# Altium schematic sheet Peripherals.SchDoc
size A3; SheetNumber: 7; SheetTotal: 13
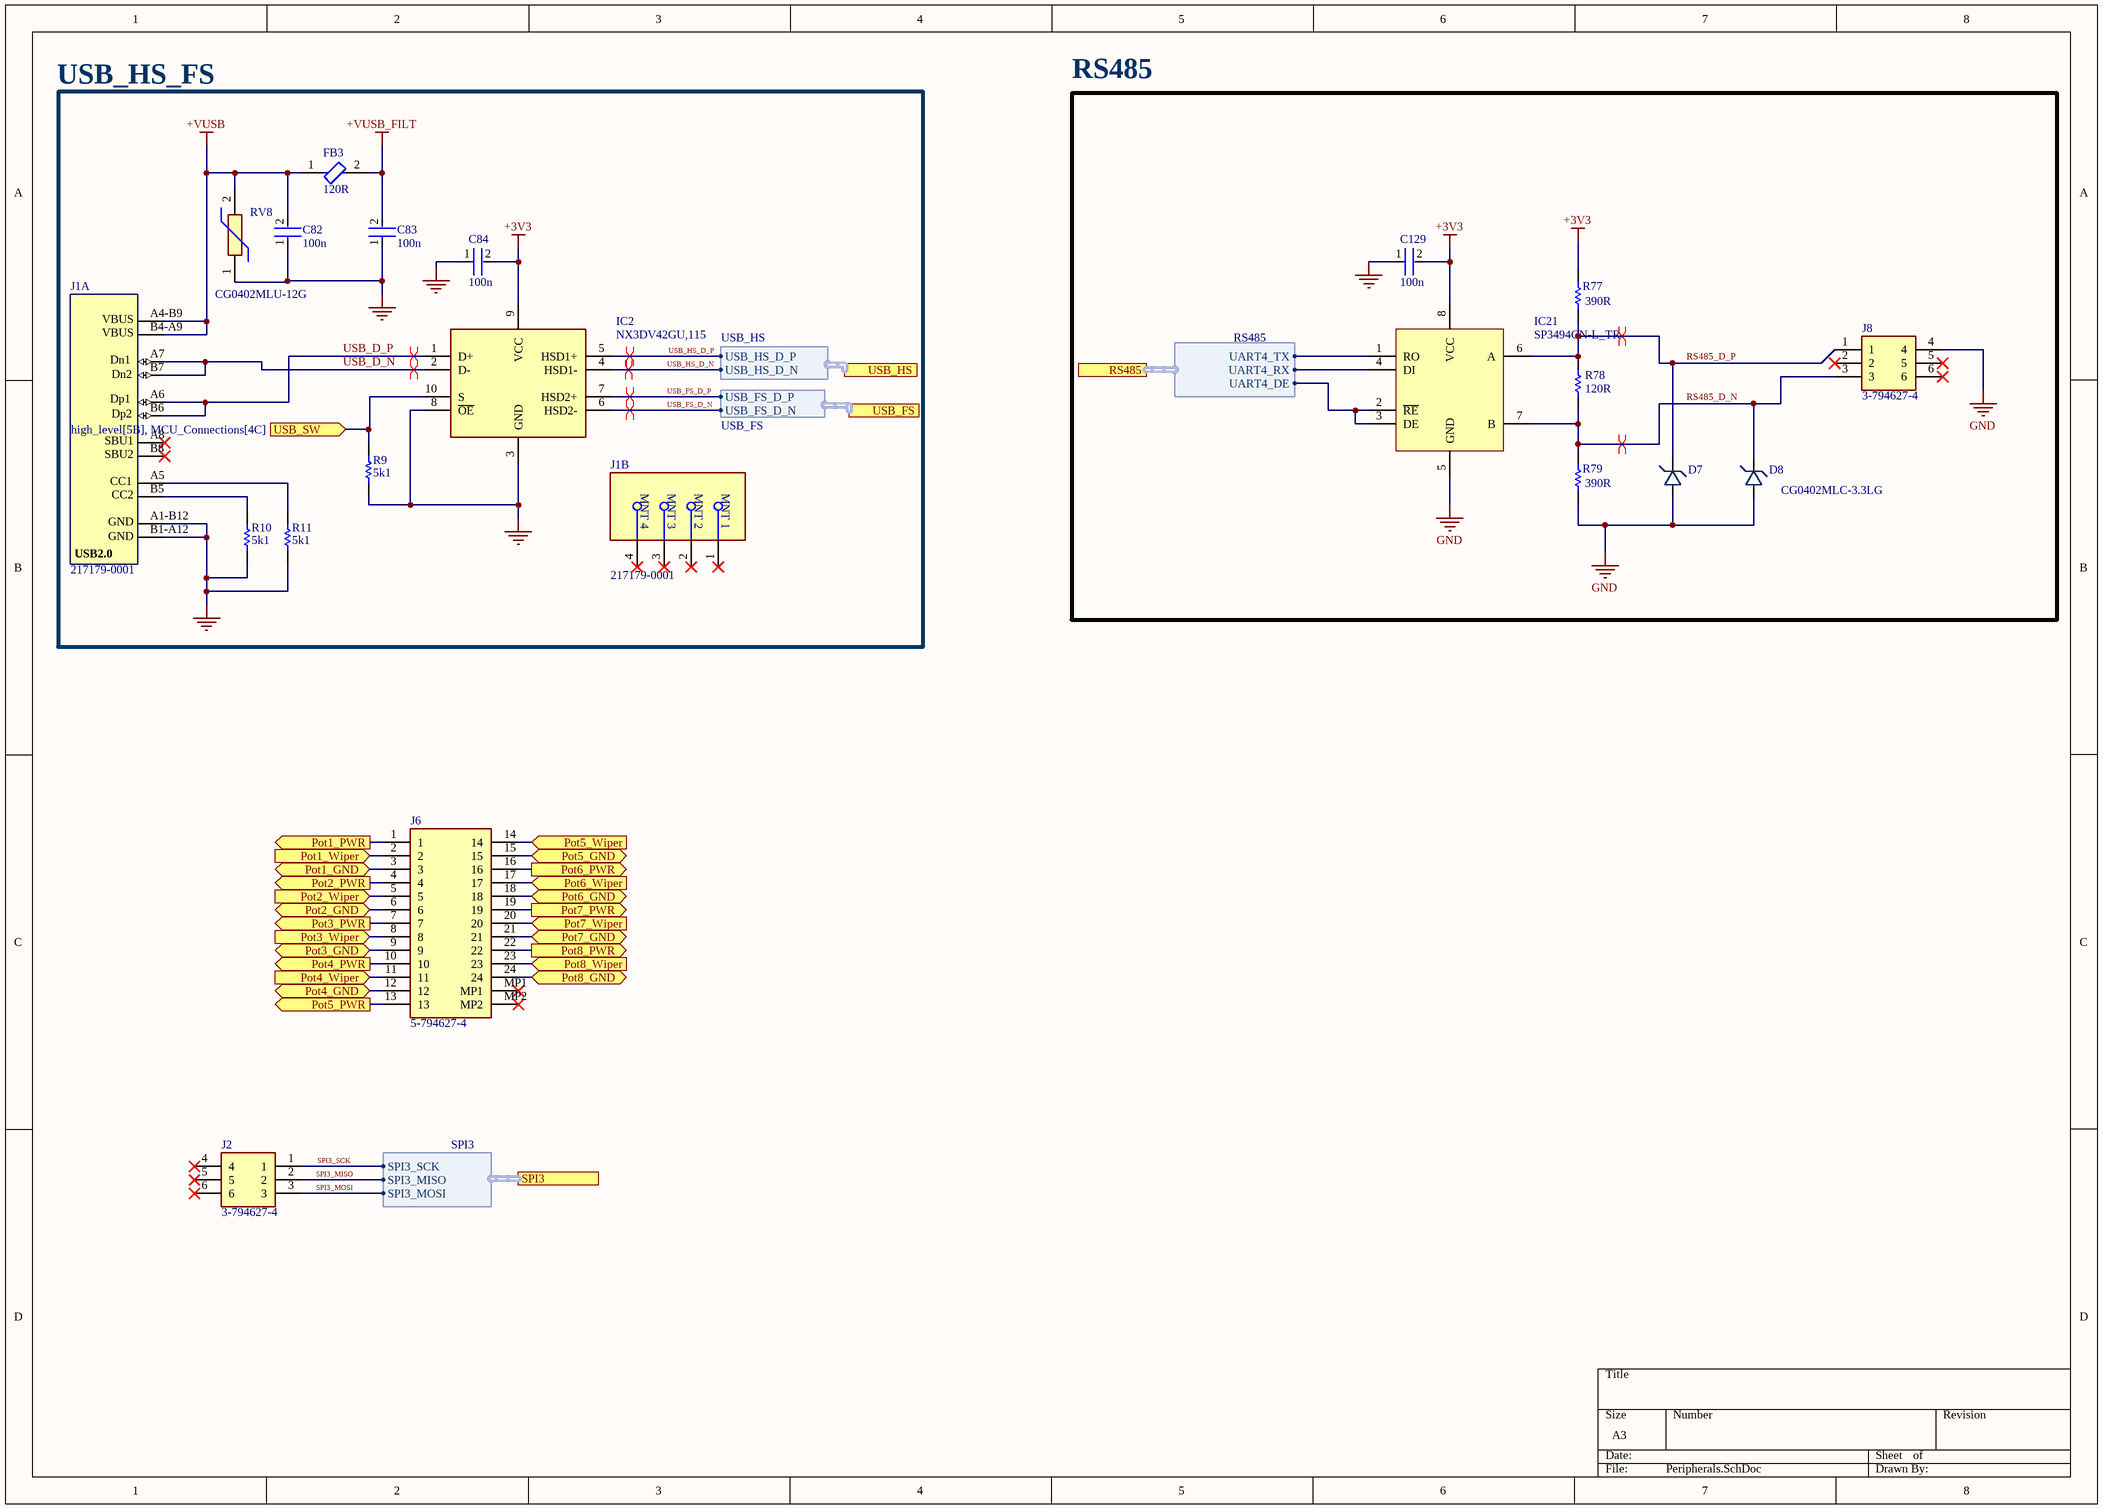
[diagram p0: Peripherals.SchDoc]

## Parts
C82  Capacitance: 100n  [FP-GCM155-0_05-IPC_A]  (hidden comment: GCM155R71H104ME02J)
C83  Capacitance: 100n  [FP-GCM155-0_05-IPC_A]  (hidden comment: GCM155R71H104ME02J)
C84  Capacitance: 100n  [FP-GCM155-0_05-IPC_A]  (hidden comment: GCM155R71H104ME02J)
C129  Capacitance: 100n  [FP-GCM155-0_05-IPC_A]  (hidden comment: GCM155R71H104ME02J)
D7  CG0402MLC-3.3LG  [CG0402MLC-3.3LG]  (value not drawn)
D8  CG0402MLC-3.3LG  [CG0402MLC-3.3LG]
FB3  Impedance: 120R  [FP-MPZ1005-MFG]  (hidden comment: MPZ1005S121ET000)
IC2  NX3DV42GU,115  [QFN40P140X180X50-10N]
IC21  SP3494CN-L_TR  [SOIC127P600X175-8N]
J1  217179-0001  [FP-2171790001-MFG]  (parts A,B of 2)
J2  3-794627-4  [37946274]
J6  5-794627-4  [57946274]
J8  3-794627-4  [37946274]
R9  Resistance: 5k1  [RESC1005X40X25ML05T10]  (hidden comment: RC0402JR-075K1L)
R10  Resistance: 5k1  [RESC1005X40X25ML05T10]  (hidden comment: RC0402JR-075K1L)
R11  Resistance: 5k1  [RESC1005X40X25ML05T10]  (hidden comment: RC0402JR-075K1L)
R77  Resistance: 390R  [RESC1005X40X25ML05T10]  (hidden comment: RC0402JR-07390RL)
R78  Resistance: 120R  [RESC1005X40X25NL05T10]  (hidden comment: RC0402FR-07120RL)
R79  Resistance: 390R  [RESC1005X40X25ML05T10]  (hidden comment: RC0402JR-07390RL)
RV8  CG0402MLU-12G  [VARC1005X41N]

## Blocks framed on the sheet
USB_HS_FS: C82-C84 FB3 IC2 J1 R9-R11 RV8
RS485: C129 D7 D8 IC21 J8 R77-R79

## Ports
Pot1_GND (bidir, see high_level[5C], Potentiometers[1B]), Pot1_PWR (out, see high_level[5C], Potentiometers[1A]), Pot1_Wiper (in, see high_level[5C], Potentiometers[1A]), Pot2_GND (bidir, see high_level[5C], Potentiometers[1B]), Pot2_PWR (out, see high_level[5C], Potentiometers[1B]), Pot2_Wiper (in, see high_level[5C], Potentiometers[1B]), Pot3_GND (bidir, see high_level[5C], Potentiometers[1C]), Pot3_PWR (out, see high_level[5C], Potentiometers[1C]), Pot3_Wiper (in, see high_level[5C], Potentiometers[1C]), Pot4_GND (bidir, see high_level[5C], Potentiometers[5B]), Pot4_PWR (out, see high_level[5C], Potentiometers[5A]), Pot4_Wiper (in, see high_level[5C], Potentiometers[5A]), Pot5_GND (bidir, see high_level[5C], Potentiometers[5B]), Pot5_PWR (out, see high_level[5C], Potentiometers[5B]), Pot5_Wiper (in, see high_level[5C], Potentiometers[5B]), Pot6_GND (bidir, see high_level[5C], Potentiometers[5C]), Pot6_PWR (out, see high_level[5C], Potentiometers[5C]), Pot6_Wiper (in, see high_level[5C], Potentiometers[5C]), Pot7_GND (bidir, see high_level[5C], Potentiometers[1D]), Pot7_PWR (out, see high_level[5C], Potentiometers[1D]), Pot7_Wiper (in, see high_level[5C], Potentiometers[1D]), Pot8_GND (bidir, see high_level[5C], Potentiometers[5D]), Pot8_PWR (out, see high_level[5C], Potentiometers[5D]), Pot8_Wiper (in, see high_level[5C], Potentiometers[5D]), RS485 (harness RS485, see high_level[5B], MCU_Connections[4C]), SPI3 (harness SPI3, see high_level[5B], MCU_Connections[5C]), USB_FS (harness USB_FS, see high_level[5B], MCU_Connections[4C]), USB_HS (harness USB_HS, see high_level[5B], USB_HS[4B]), USB_SW (in, see high_level[5B], MCU_Connections[4C])

## Harnesses
USB_HS: USB_HS_D_P, USB_HS_D_N
USB_FS: USB_FS_D_P, USB_FS_D_N
SPI3: SPI3_SCK, SPI3_MISO, SPI3_MOSI
RS485: UART4_TX, UART4_RX, UART4_DE

## Nets
+3V3: C84.2 C129.2 IC2.9(VCC) IC21.8(VCC) R77.2
+VUSB: C82.2 FB3.1 J1.A4-B9(VBUS) J1.B4-A9(VBUS) RV8.2
+VUSB_FILT: C83.2 FB3.2
GND: C82.1 C83.1 C84.1 C129.1 D7.2 D8.2 IC2.3(GND) IC2.8(~{OE}) IC21.5(GND) J1.A1-B12(GND) J1.B1-A12(GND) J8.4 R9.1 R10.1 R11.1 R79.1 RV8.1
Pot1_GND: J6.3 ; port Pot1_GND
Pot1_PWR: J6.1 ; port Pot1_PWR
Pot1_Wiper: J6.2 ; port Pot1_Wiper
Pot2_GND: J6.6 ; port Pot2_GND
Pot2_PWR: J6.4 ; port Pot2_PWR
Pot2_Wiper: J6.5 ; port Pot2_Wiper
Pot3_GND: J6.9 ; port Pot3_GND
Pot3_PWR: J6.7 ; port Pot3_PWR
Pot3_Wiper: J6.8 ; port Pot3_Wiper
Pot4_GND: J6.12 ; port Pot4_GND
Pot4_PWR: J6.10 ; port Pot4_PWR
Pot4_Wiper: J6.11 ; port Pot4_Wiper
Pot5_GND: J6.15 ; port Pot5_GND
Pot5_PWR: J6.13 ; port Pot5_PWR
Pot5_Wiper: J6.14 ; port Pot5_Wiper
Pot6_GND: J6.18 ; port Pot6_GND
Pot6_PWR: J6.16 ; port Pot6_PWR
Pot6_Wiper: J6.17 ; port Pot6_Wiper
Pot7_GND: J6.21 ; port Pot7_GND
Pot7_PWR: J6.19 ; port Pot7_PWR
Pot7_Wiper: J6.20 ; port Pot7_Wiper
Pot8_GND: J6.24 ; port Pot8_GND
Pot8_PWR: J6.22 ; port Pot8_PWR
Pot8_Wiper: J6.23 ; port Pot8_Wiper
RS485_D_N: D8.1 IC21.7(B) J8.3 R78.1 R79.2
RS485_D_P: D7.1 IC21.6(A) J8.1 R77.1 R78.2
SPI3_MISO: J2.2 ; port SPI3.SPI3_MISO
SPI3_MOSI: J2.3 ; port SPI3.SPI3_MOSI
SPI3_SCK: J2.1 ; port SPI3.SPI3_SCK
USB_D_N: IC2.2(D-) J1.A7(Dn1) J1.B7(Dn2)
USB_D_P: IC2.1(D+) J1.A6(Dp1) J1.B6(Dp2)
USB_FS_D_N: IC2.6(HSD2-) ; port USB_FS.USB_FS_D_N
USB_FS_D_P: IC2.7(HSD2+) ; port USB_FS.USB_FS_D_P
USB_HS_D_N: IC2.4(HSD1-) ; port USB_HS.USB_HS_D_N
USB_HS_D_P: IC2.5(HSD1+) ; port USB_HS.USB_HS_D_P
USB_SW: IC2.10(S) R9.2 ; port USB_SW
NetIC21_1: IC21.1(RO) ; port RS485.UART4_TX
NetIC21_2: IC21.2(~{RE}) IC21.3(DE) ; port RS485.UART4_DE
NetIC21_4: IC21.4(DI) ; port RS485.UART4_RX
NetJ1_A5: J1.A5(CC1) R11.2
NetJ1_B5: J1.B5(CC2) R10.2

Not connected (* = marked no-connect by the designer): J1 1(MNT_1)* 2(MNT_2)* 3(MNT_3)* 4(MNT_4)* A8(SBU1)* B8(SBU2)*; J2 4* 5* 6*; J6 MP1* MP2*; J8 2* 5* 6*

## Layout directives
differential pair: (no net found under the mark), RS485_D_N, RS485_D_P, USB_D_N, USB_D_P, USB_FS_D_N, USB_FS_D_P, USB_HS_D_P

## Notes on the sheet
- (in symbol CMP-04767-000028-2, part A) USB2.0

## Library data of the parts
C82-C84 C129 = CMP-06035-028957-1: Ceramic Capacitor for Automotive 100nF ±20% 50VDC X7R 0402 Paper T/R
FB3 = CMP-08257-000274-1: Power line Ferrite Bead 120Ω @ 100MHz 1.5A DCR 0.095Ω SMD 0402; Tolerance: 25%; Number of Lines: 1; DC Resistance (DCR): 95mR; RoHS Compliant: Yes; Test Frequency: 100MHz; Length: 0.039inch; Case Code (Metric): 1005; Case/Package: 0402; Max Operating Temperature: 125°C; Max Current Rating: 1.5A; Termination: SMD/SMT; Case Code (Imperial): 0402; Width: 0.02inch; Weight: 2.3E-05oz; Max DC Current: 1.5A; Height: 0.022inch; Package Quantity: 10000; Mount: Surface Mount; Min Operating Temperature: -55°C; Packaging: Tape and Reel
IC2 = NX3DV42GU,115: Integrated Circuit; Manufacturer_Name: NXP; Datasheet Link: http://www.nxp.com/docs/en/data-sheet/NX3DV42.pdf; Height: 0.5mm; Manufacturer_Part_Number: NX3DV42GU,115; Mouser Part Number: 771-NX3DV42GU115; Mouser Price/Stock: https://www.mouser.co.uk/ProductDetail/NXP-Semiconductors/NX3DV42GU115?qs=cbprxTG2Yq%252BinzuyAklGVQ%3D%3D; Arrow Part Number: NX3DV42GU,115; Arrow Price/Stock: https://www.arrow.com/en/products/nx3dv42gu115/nxp-semiconductors?region=nac
IC21 = SP3494CN-L_TR: Integrated Circuit; Manufacturer_Name: MaxLinear; Manufacturer_Part_Number: SP3494CN-L/TR; Datasheet Link: https://www.arrow.com/en/products/sp3494cn-ltr/maxlinear-inc?region=nac; Height: 1.75mm; Mouser Part Number: 701-SP3494CN-L/TR; Mouser Price/Stock: https://www.mouser.co.uk/ProductDetail/MaxLinear/SP3494CN-L-TR?qs=3EMgrMjM0faUFCPV%252BPTaUQ%3D%3D; Arrow Part Number: SP3494CN-L/TR; Arrow Price/Stock: https://www.arrow.com/en/products/sp3494cn-ltr/maxlinear-inc?region=nac
J1 = CMP-04767-000028-2: CONN RCP USB2.0 TYP C 24P SMD RA; NexarPartId: 117190526; Gender: Receptacle; Number of Contacts: 16; Current Rating: 1.25A; Voltage Rating: 30V; Min Operating Temperature: -40°C; USB Standard: USB 2.0; Height: 3.36mm; Contact Material: Gold, Nickel; Max Operating Temperature: 85°C
J2 J8 = 3-794627-4: Connector; Manufacturer_Name: TE Connectivity; Datasheet Link: https://www.te.com/commerce/DocumentDelivery/DDEController?Action=srchrtrv&DocNm=micro-mate-n-lok-connector-qrg&DocType=Data%20Sheet&DocLang=English&PartCntxt=3-794627-4&DocFormat=pdf; Height: 8.8mm; Manufacturer_Part_Number: 3-794627-4; Mouser Part Number: 571-3-794627-4; Mouser Price/Stock: https://www.mouser.co.uk/ProductDetail/TE-Connectivity-AMP/3-794627-4?qs=FGSkXkE%2FZ3Wegb353BDzUA%3D%3D; Arrow Part Number: 3-794627-4; Arrow Price/Stock: https://www.arrow.com/en/products/3-794627-4/te-connectivity?utm_currency=USD&region=europe
J6 = 5-794627-4: Connector; Manufacturer_Name: TE Connectivity; Datasheet Link: https://www.te.com/commerce/DocumentDelivery/DDEController?Action=srchrtrv&DocNm=micro-mate-n-lok-connector-qrg&DocType=Data%20Sheet&DocLang=English&PartCntxt=5-794627-4&DocFormat=pdf; Height: 8.8mm; Manufacturer_Part_Number: 5-794627-4
R9-R11 = CMP-2002-08025-1: Manufacturer: Yageo / Phycomp; Part Number: RC0402JR-075K1L
R77 R79 = CMP-2002-07992-1: Manufacturer: Yageo / Phycomp; Part Number: RC0402JR-07390RL
R78 = CMP-2002-07370-1: Manufacturer: Yageo / Phycomp; Part Number: RC0402FR-07120RL
RV8 = CG0402MLU-12G: Varistor; Manufacturer_Name: Bourns; Datasheet Link: https://bourns.com/docs/product-datasheets/mlu.pdf?sfvrsn=1940d498_27; Height: 0.41mm; Manufacturer_Part_Number: CG0402MLU-12G; Mouser Part Number: 652-CG0402MLU-12G; Mouser Price/Stock: https://www.mouser.co.uk/ProductDetail/Bourns/CG0402MLU-12G?qs=m8myXnDJXpUNz33UIHxVhA%3D%3D; Arrow Part Number: CG0402MLU-12G; Arrow Price/Stock: https://www.arrow.com/en/products/cg0402mlu-12g/bourns?utm_currency=USD&region=nac